# Altium schematic sheet 08 USB OTG & POWER.SchDoc
size A3
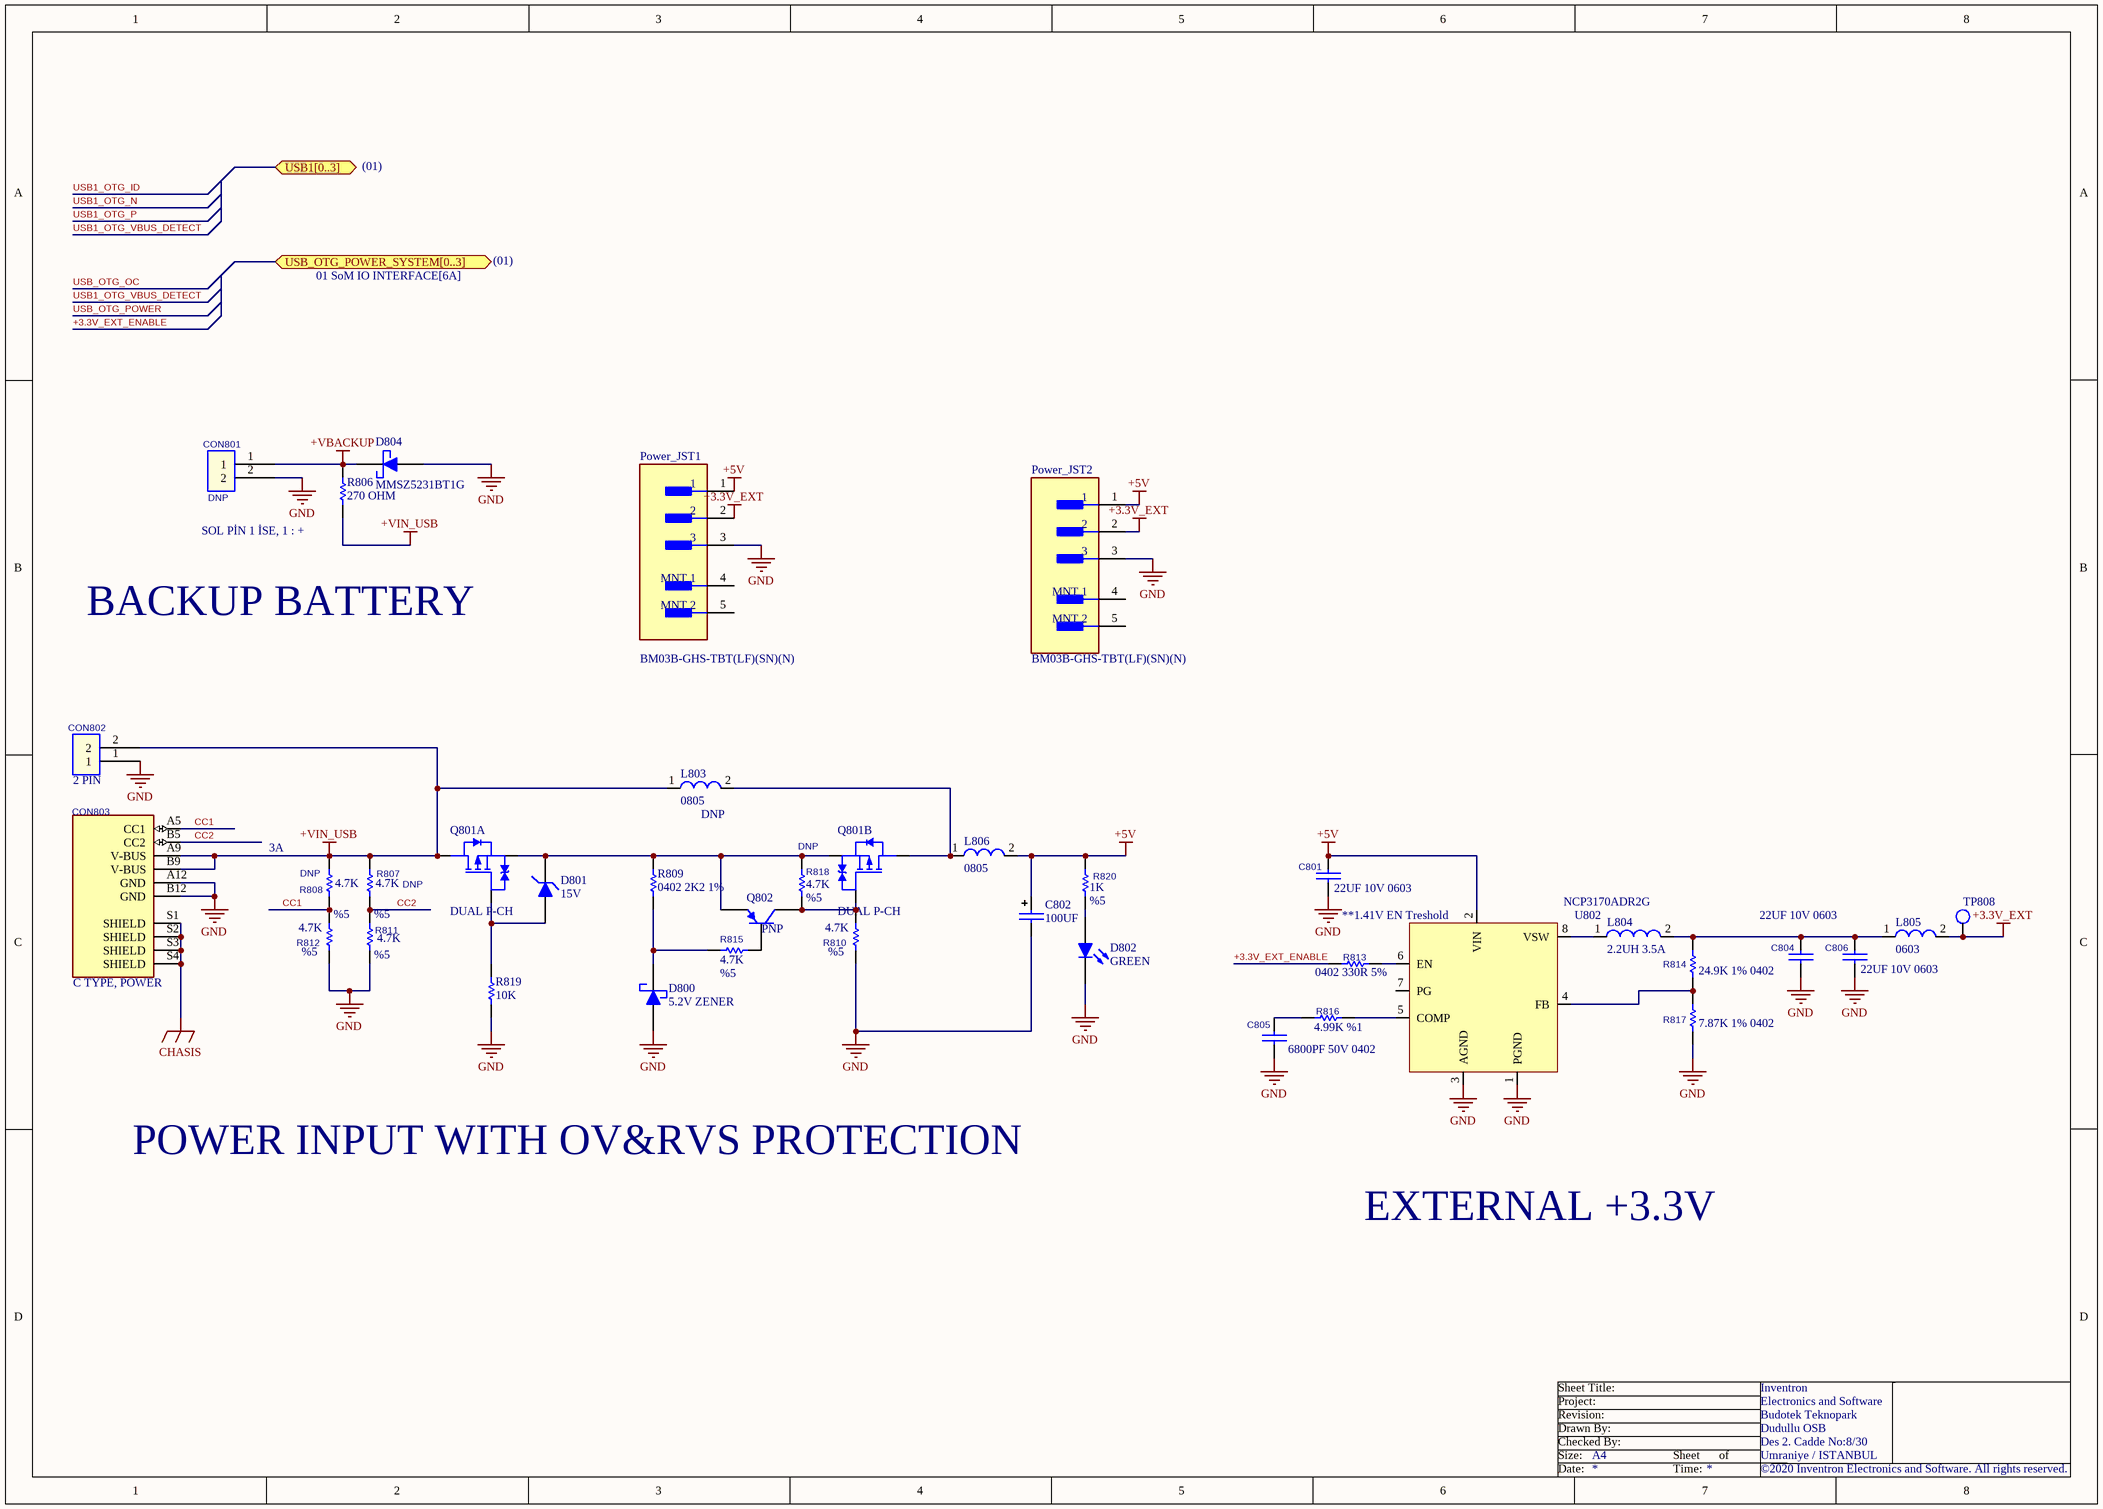
[diagram p0: 08 USB OTG & POWER.SchDoc]

## Parts
C801  22UF 10V 0603  [0603_CC]
C802  100UF  [UWR1A101MCL1GB]
C804  22UF 10V 0603  [0603_CC]
C805  6800PF 50V 0402  [0402_CC]
C806  22UF 10V 0603  [0603_CC]
CON801  ASSY_OPT: DNP  [B2B-PH-K-S]  (hidden comment: CON-B2B-PH-K-S(LF)(SN))
CON802  2 PIN  [640456-2]
CON803  C TYPE, POWER  [CUI_UJC-HP-3-SMT-TR]
D800  5.2V ZENER  [SOD-323]
D801  15V  [SOD-323]
D802  GREEN  [0603_LED]
D804  MMSZ5231BT1G  [SOD-123]  (no BOM)
L803  0805  ASSY_OPT: DNP  [0805]  (no BOM)
L804  2.2UH 3.5A  [IND-NRS5030T2R2NMGJ]
L805  0603  [0603_RES]
L806  0805  [0805]
Power_JST1  BM03B-GHS-TBT(LF)(SN)(N)  [FP-BM03B-GHS-TBT_LF_SN-MFG]
Power_JST2  BM03B-GHS-TBT(LF)(SN)(N)  [FP-BM03B-GHS-TBT_LF_SN-MFG]
Q801  DUAL P-CH  [SO-8 - DUAL MOS - NAMED]  (parts A,B of 2)
Q802  PNP  [SOT23]
R806  270 OHM  [0603_RES]  (no BOM)
R807  4.7K  ASSY_OPT: DNP  Tolerance: %5  [0402_RES]
R808  4.7K  ASSY_OPT: DNP  Tolerance: %5  [0402_RES]
R809  0402 2K2 1%  [0402_RES]
R810  4.7K  Tolerance: %5  [0402_RES]
R811  4.7K  Tolerance: %5  [0402_RES]
R812  4.7K  Tolerance: %5  [0402_RES]
R813  0402 330R 5%  [0402_RES]
R814  24.9K 1% 0402  [0402_RES]
R815  4.7K  Tolerance: %5  [0402_RES]
R816  4.99K %1  [0603_RES]
R817  7.87K 1% 0402  [0402_RES]
R818  4.7K  ASSY_OPT: DNP  Tolerance: %5  [0402_RES]  (no BOM)
R819  10K  [0805]
R820  1K  Tolerance: %5  [0402_RES]
TP808  TEST POINT 35  [testpoint_35mil]  (value not drawn)  (no BOM)
U802  NCP3170ADR2G  [IC-NCP3170ADR2G]

## Ports
USB1[0..3] (bidir), USB_OTG_POWER_SYSTEM[0..3] (bidir, see 01 SoM IO INTERFACE[6A])

## Nets
+3.3V_EXT: L805.2 Power_JST1.2 Power_JST2.2 TP808.1
+5V: C801.1 C802.1 L806.2 Power_JST1.1 Power_JST2.1 R820.1 U802.2(VIN)
+VBACKUP: CON801.1 D804.K R806.1
+VIN_USB: CON802.2 CON803.A9(V-BUS) CON803.B9(V-BUS) L803.1 Q801.D1 R806.2 R807.1 R808.1
CHASIS: CON803.S1(SHIELD) CON803.S2(SHIELD) CON803.S3(SHIELD) CON803.S4(SHIELD)
GND: C801.2 C802.2 C804.2 C805.2 C806.2 CON801.2 CON802.1 CON803.A12(GND) CON803.B12(GND) D800.A D802.2(K) D804.A Power_JST1.3 Power_JST2.3 R810.2 R811.2 R812.2 R817.1 R819.1 U802.1(PGND) U802.3(AGND)
+3.3V_EXT_ENABLE: R813.1
CC1: CON803.A5(CC1) R808.2 R812.1
CC2: CON803.B5(CC2) R807.2 R811.1
NetC804_1: C804.1 C806.1 L804.2 L805.1 R814.2
NetC805_1: C805.1 R816.1
NetD800_K: D800.K R809.1 R815.1
NetD801_A: D801.A Q801.G1 R819.2
NetD801_K: D801.K Q801.S1 Q801.S2 Q802.2(E) R809.2 R818.2
NetD802_1: D802.1(A) R820.2
NetL803_2: L803.2 L806.1 Q801.D2
NetL804_1: L804.1 U802.8(VSW)
NetQ801_G2: Q801.G2 Q802.3(C) R810.1 R818.1
NetQ802_1: Q802.1(B) R815.2
NetR813_2: R813.2 U802.6(EN)
NetR814_1: R814.1 R817.2 U802.4(FB)
NetR816_2: R816.2 U802.5(COMP)

Not connected (* = marked no-connect by the designer): Power_JST1 4(MNT_1) 5(MNT_2); Power_JST2 4(MNT_1) 5(MNT_2); U802 7(PG)

## Notes on the sheet
- (01)
- (near R806) SOL PİN 1 İSE, 1 : +
- BACKUP BATTERY
- (near R808) 3A
- (near U802) **1.41V EN Treshold
- POWER INPUT WITH OV&RVS PROTECTION
- EXTERNAL +3.3V
- Sheet Title:
- Inventron
- Size:
- Drawn By:
- Revision:
- Project:
- Checked By:
- A4
- Sheet
- of
- Budotek Teknopark
- Dudullu OSB
- Des 2. Cadde No:8/30
- Umraniye / ISTANBUL
- Electronics and Software
- Date:
- Time:
- ©2020 Inventron Electronics and Software. All rights reserved.

## Library data of the parts
C801 C804 C806 = CAP-C1608X5R1A226M080AC: ±20% 10V Ceramic Capacitor X5R 0603 (1608 Metric); Manufacturer-1: Murata Electronics; Manufacturer Part Number-1: C1608X5R1A226M080AC; Footprint: 0603; Manufacturer-2: *; Manufacturer Part Number-2: *; Inventron Stock No: *; Created By: E.E; Created Date: 2.11.2020; Checked By: *; ASSY_OPT: *; Dimensions: *; Unit Price: *; Revision Date/Note: *; Price Break: *; Opt. Temp.: *; Class: Capacitor; Features: *
C802 = CAP-UWR1A101MCL1GB: CAP ALUM 100UF 20% 10V SMD; Manufacturer-1: Nichicon; Class: Capacitor; Manufacturer Part Number-1: UWR1A101MCL1GB; Footprint: *; Manufacturer-2: *; Manufacturer Part Number-2: *; Inventron Stock No: *; Created By: EE; Created Date: *; Checked By: *; ASSY_OPT: *; Dimensions: *; Unit Price: 0.05481; Revision Date/Note: *; Price Break: 1000; Opt. Temp.: *; Features: *
C805 = CAP-CL05B682KB5NNNC: 6800pF ±10% 50V Ceramic Capacitor X7R 0402 (1005 Metric); Manufacturer-1: Samsung Electro-Mechanics; Manufacturer Part Number-1: CL05B682KB5NNNC; Footprint: 0402; Manufacturer-2: *; Manufacturer Part Number-2: *; Inventron Stock No: *; Created By: E.E; Created Date: 15.11.2020; Checked By: *; ASSY_OPT: *; Dimensions: *; Unit Price: *; Revision Date/Note: *; Price Break: *; Opt. Temp.: *; Class: Capacitor; Features: *
CON801 = CON-B2B-PH-K-S(LF)(SN): CONN HEADER VERT 2POS 2MM; Manufacturer-1: JST; Class: Connector; Manufacturer Part Number-1: B2B-PH-K-S(LF)(SN); Footprint: *; Manufacturer-2: *; Manufacturer Part Number-2: *; Inventron Stock No: *; Created By: LA; Created Date: 16.05.2019; Checked By: *; Dimensions: *; Unit Price: 0,072; Revision Date/Note: *; Price Break: 1K; Opt. Temp.: *
CON802 = CON-640456-2: CONN HEADER VERT 2POS 2.54MM; Manufacturer-1: TE; Class: Connector; Manufacturer Part Number-1: 640456-2; Footprint: *; Manufacturer-2: *; Manufacturer Part Number-2: *; Inventron Stock No: *; Created By: LA; Created Date: 16.05.2019; Checked By: *; ASSY_OPT: *; Dimensions: *; Unit Price: 0,048; Revision Date/Note: *; Price Break: 1K; Opt. Temp.: *
CON803 = 0-CON-UJC-HP-3-SMT-TR: USB JACK, C TYPE, POWER ONLY, 6; Manufacturer-1: CUI Devices; Opt. Temp.: -40°C ~ 80°C; Class: Connector; Manufacturer Part Number-1: UJC-HP-3-SMT-TR; Footprint: C TYPE, POWER ONLY, 6; Manufacturer-2: *; Manufacturer Part Number-2: *; Inventron Stock No: *; Created By: E.E; Created Date: 30.10.2020; Checked By: *; ASSY_OPT: *; Dimensions: *; Unit Price: 0.360; Revision Date/Note: *; Price Break: *; Features: *
D800 = DIODE-PZU5.1B2A,115: DIODE ZENER 5.1V 320MW SOD323; Manufacturer-1: Nexperia USA Inc.; Manufacturer Part Number-1: PZU5.1B2A,115; Manufacturer-2: *; Manufacturer Part Number-2: *; Inventron Stock No: *; Created By: EE; Checked By: *; ASSY_OPT: *; Dimensions: *; Revision Date/Note: *; Class: Diode
D801 = DIODE-PDZ15B,115: DIODE ZENER 15V 400MW SOD323; Manufacturer-1: Nexperia USA Inc.; Manufacturer Part Number-1: PDZ15B,115; Footprint: *; Manufacturer-2: *; Manufacturer Part Number-2: *; Inventron Stock No: *; Created By: LA; Created Date: *; Checked By: *; ASSY_OPT: *; Dimensions: *; Revision Date/Note: *; Opt. Temp.: *; Class: Diode
D802 = LED-LTST-C190KRKT: LED SMD 0603 SUPER GREEN; Manufacturer-1: LITEON; Manufacturer Part Number-1: LTST-C190KRKT; Footprint: *; Manufacturer-2: *; Manufacturer Part Number-2: *; Inventron Stock No: *; Created By: *; Created Date: *; Checked By: *; ASSY_OPT: *; Dimensions: *; Unit Price: 0.03343; Revision Date/Note: *; Price Break: 4000; Opt. Temp.: *; Class: Led; Features: *
D804 = DIODE-MMSZ5231BT1G: DIODE ZENER 5.1V 500MW SOD123; Manufacturer-1: ON Semiconductor; ASSY_OPT: DNP; Manufacturer Part Number-1: MMSZ5231BT1G; Manufacturer-2: *; Manufacturer Part Number-2: *; Inventron Stock No: *; Created By: EE; Checked By: *; Dimensions: *; Revision Date/Note: *; Class: Diode
L803 L806 = IND-FERRITE (RES 0 OHM) 0805: 0OHM 0805; Manufacturer Part Number-1: AC0805JR-070RL; Manufacturer-1: YAGEO; Class: Inductor; Manufacturer-2: *; Inventron Stock No: *; Created By: EE; Checked By: *; Dimensions: *; Revision Date/Note: *
  L806: ASSY_OPT: *
L804 = IND-NRS5030T2R2NMGJ: Shielded Wirewound Inductor 23mOhm Nonstandard; Manufacturer-1: Taiyo Yuden; Manufacturer Part Number-1: NRS5030T2R2NMGJ; Footprint: *; Manufacturer-2: *; Manufacturer Part Number-2: *; Inventron Stock No: *; Created By: E.E; Created Date: 3.11.2020; Checked By: *; ASSY_OPT: *; Dimensions: *; Unit Price: *; Revision Date/Note: *; Price Break: *; Opt. Temp.: *; Class: Inductor; Features: *
L805 = IND-FERRITE (RES 0 OHM) 0603: 0OHM 0603; Manufacturer Part Number-1: RC0603JR-070RL; Manufacturer-1: YAGEO; Class: Inductor; Footprint: 0603; Manufacturer-2: *; Inventron Stock No: *; Created By: EE; Checked By: *; ASSY_OPT: *; Dimensions: *; Revision Date/Note: *
Power_JST1 Power_JST2 = CMP-17439-000058-1: CONN HEADER SMD 3POS 1.25MM; Pitch: 0.049inch; Number of Positions: 3; Contact Finish - Mating: TIN; Lead Free: Lead Free; Series: GH; Fastening Type: Ramp; Number of Rows: 1; Insulation Color: Natural; Contact Material: Bronze; Insulation Material: Nylon; Min Operating Temperature: -25°C; Contact Type: Outer Shroud Contact; Max Operating Temperature: 85°C; Termination: Solder; Flammability Rating: UL94 V-0; Color: Natural; Contact Plating: Tin; Contact Shape: Rectangular; Mount: Surface Mount; Packaging: Cut Tape; Connector Type: Header
Q801 = MOS-P-DMP3028LSD-13: MOSFET 2P-CH 30V 6A SO-8; Manufacturer-1: Diodes Incorporated; Class: Transistor; Manufacturer Part Number-1: DMP3028LSD-13; Footprint: SO-8; Manufacturer-2: *; Manufacturer Part Number-2: *; Inventron Stock No: *; Created By: *; Created Date: *; Checked By: *; ASSY_OPT: *; Dimensions: *; Unit Price: *; Revision Date/Note: *; Price Break: *; Opt. Temp.: *; Features: *
Q802 = TRANSISTOR-BC856: TRANS PNP 65V 0.1A SOT-23; Manufacturer Part Number-1: BC856; Manufacturer-1: ON Semi; Footprint: *; Manufacturer-2: *; Manufacturer Part Number-2: *; Inventron Stock No: *; Created By: LA; Created Date: *; Checked By: *; ASSY_OPT: *; Dimensions: *; Unit Price: *; Revision Date/Note: *; Price Break: *; Opt. Temp.: *; Class: TRANSISTOR
R806 = RES-RC0603JR-07270RL: RES SMD 270 OHM 5% 1/10W 0603; Manufacturer-1: Yageo; ASSY_OPT: DNP; Class: Resistor; Manufacturer Part Number-1: RC0603JR-07270RL; Footprint: 0603; Manufacturer-2: *; Manufacturer Part Number-2: *; Inventron Stock No: *; Created By: EE; Created Date: *; Checked By: *; Dimensions: *; Unit Price: *; Revision Date/Note: *; Price Break: *; Opt. Temp.: *; Tolerance: *
R807 R808 R810-R812 R815 R818 = RES-4.7K: RES 4.7K OHM 5% 1/16W 0402; Manufacturer Part Number-1: RC0402JR-074K7L; Manufacturer-1: Yageo; Opt. Temp.: -55/+155; Class: Resistor; Footprint: 0402; Manufacturer-2: *; Manufacturer Part Number-2: *; Inventron Stock No: *; Created By: LA; Checked By: *; Dimensions: *; Revision Date/Note: *
  R810-R812 R815: ASSY_OPT: *
R809 = RES-CRGCQ0402F2K2: 2.2 ±1% 0.063W, 1/16W Chip Resistor 0402 (1005 Metric) Automotive AEC-Q200, Moisture Resistant Thick Film; Manufacturer-1: TE Connectivity Passive Product; Opt. Temp.: -55°C ~ 155°C; Manufacturer Part Number-1: CRGCQ0402F2K2; Footprint: 0402; Manufacturer-2: *; Manufacturer Part Number-2: *; Inventron Stock No: *; Created By: E.E; Created Date: 22.10.2020; Checked By: *; ASSY_OPT: *; Dimensions: *; Unit Price: *; Revision Date/Note: *; Price Break: *; Class: Resistor; Tolerance: *
R813 = RES-CRGCQ0402J330R: 330 ±5% 0.063W, 1/16W Chip Resistor 0402 (1005 Metric) Automotive AEC-Q200, Moisture Resistant Thick Film; Manufacturer-1: TE Connectivity Passive Product; Opt. Temp.: -55°C ~ 155°C; Tolerance: %5; Manufacturer Part Number-1: CRGCQ0402J330R; Footprint: 0402; Manufacturer-2: *; Manufacturer Part Number-2: *; Inventron Stock No: *; Created By: E.E; Created Date: 23.10.2020; Checked By: *; ASSY_OPT: *; Dimensions: *; Unit Price: *; Revision Date/Note: *; Price Break: *; Class: Resistor
R814 = RES-RC0402FR-0724K9L: 24.9 ±1% 0.063W, 1/16W Chip Resistor 0402 (1005 Metric) - Thick Film; Manufacturer-1: Yageo; Opt. Temp.: -55°C ~ 155°C; Manufacturer Part Number-1: RC0402FR-0724K9L; Footprint: 0402; Manufacturer-2: *; Manufacturer Part Number-2: *; Inventron Stock No: *; Created By: E.E; Created Date: 19.10.2020; Checked By: *; ASSY_OPT: *; Dimensions: *; Unit Price: *; Revision Date/Note: *; Price Break: *; Class: Resistor; Tolerance: *
R816 = RES-RC0603FR-074K99L: RES 4.99K OHM %1 1/10W 0603; Manufacturer-1: YAGEO; Opt. Temp.: -55/+155; Class: Resistor; Manufacturer Part Number-1: RC0603FR-074K99L; Footprint: 0603; Manufacturer-2: *; Manufacturer Part Number-2: *; Inventron Stock No: *; Created By: LA; Created Date: *; Checked By: *; ASSY_OPT: *; Dimensions: *; Unit Price: *; Revision Date/Note: *; Price Break: *; Tolerance: *
R817 = RES-CRCW04027K87FKED: 7.87 kOhms ±1% 0.063W, 1/16W Chip Resistor 0402 (1005 Metric) Automotive AEC-Q200 Thick Film; Manufacturer-1: Vishay Dale; Manufacturer Part Number-1: CRCW04027K87FKED; Footprint: 0402; Manufacturer-2: *; Manufacturer Part Number-2: *; Inventron Stock No: *; Created By: EE; Created Date: *; Checked By: *; ASSY_OPT: *; Dimensions: *; Unit Price: *; Revision Date/Note: *; Price Break: *; Opt. Temp.: *; Class: Resistor; Tolerance: *
R819 = RES-0805S8J0103TDE: RES SMD 10K 5% 0805; Manufacturer-1: ROYALOHM; Class: Resistor; Manufacturer Part Number-1: 0805S8J0103TDE; Manufacturer-2: *; Manufacturer Part Number-2: *; Inventron Stock No: *; Created By: *; Created Date: *; Checked By: *; ASSY_OPT: *; Dimensions: *; Unit Price: *; Revision Date/Note: *; Price Break: *; Opt. Temp.: *; Tolerance: *
R820 = RES-RMCF0402JT1K00: RES 1K OHM 5% 1/16W 0402; Manufacturer-1: STACKPOLE; Opt. Temp.: -55/+155; Class: Resistor; Manufacturer Part Number-1: RMCF0402JT1K00; Footprint: 0402; Manufacturer-2: *; Manufacturer Part Number-2: *; Inventron Stock No: *; Created By: LA; Created Date: 23.11.2018; Checked By: *; ASSY_OPT: *; Dimensions: *; Unit Price: 0,00127; Revision Date/Note: *; Price Break: 10K
U802 = IC-NCP3170ADR2G: Buck Regulator, Switching, PWM, 3.0 A; Manufacturer-1: ON Semiconductor; Opt. Temp.: -40 to +85; Class: ICs; Manufacturer Part Number-1: NCP3170ADR2G; Footprint: SOIC-8; Manufacturer-2: *; Manufacturer Part Number-2: *; Inventron Stock No: *; Created By: E.E; Created Date: 16.10.2020; Checked By: *; ASSY_OPT: *; Dimensions: *; Unit Price: 0.25; Revision Date/Note: *; Price Break: 5000